# Altium schematic sheet HX-TYPE-C 24P-1.6 USB C 3.2 REC, HORZ1_HX-TYPE-C 24P-1.6 USB C 3.2 REC, HORZ.schdoc
size 124 x 101 mm
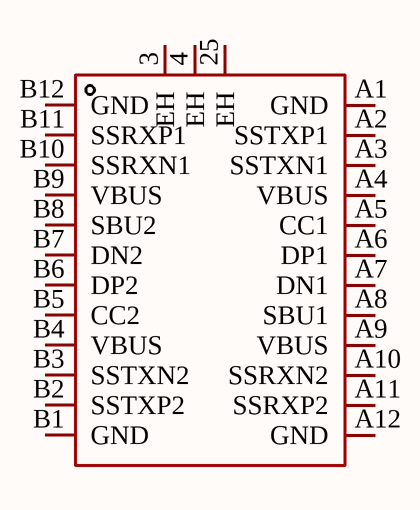
[diagram p0: HX-TYPE-C 24P-1.6 USB C 3.2 REC, HORZ1_HX-TYPE-C 24P-1.6 USB C 3.2 REC, HORZ.schdoc]

## Parts
USB?  HX-TYPE-C 24P-1.6 USB C 3.2 REC, HORZ  [USB-C-SMD_C49261591]  (value not drawn)

## Nets

Not connected (* = marked no-connect by the designer): USB? 3(EH) 4(EH) 25(EH) A1(GND) A2(SSTXP1) A3(SSTXN1) A4(VBUS) A5(CC1) A6(DP1) A7(DN1) A8(SBU1) A9(VBUS) A10(SSRXN2) A11(SSRXP2) A12(GND) B1(GND) B2(SSTXP2) B3(SSTXN2) B4(VBUS) B5(CC2) B6(DP2) B7(DN2) B8(SBU2) B9(VBUS) B10(SSRXN1) B11(SSRXP1) B12(GND)

## Library data of the parts
USB? = HX-TYPE-C 24P-1.6 USB C 3.2 REC, HORZ: Manufacturer: hanxia(韩下); Add into BOM: yes; Connector Type: Type-C; Protocol Standard: USB 3.1; Gender: Female; Number of Contacts: 24P; Number of Ports: 1; Current Rating-Power: 5A; Voltage Rating: 20V; Connect-Disconnect Life: 10,000 Cycles; Center Height: 0.08mm; Detection color: Black; Symbol: HX-TYPE-C 24P-1.6 USB C 3.2 REC, HORZ; Device: HX-TYPE-C 24P-1.6 USB C 3.2 REC, HORZ; LCSC Part Name: Type-C 母 沉板; Supplier Part: C49261591; Manufacturer Part: HX-TYPE-C 24P-1.6 USB C 3.2 REC, HORZ; Supplier Footprint: SMD; JLCPCB Part Class: Extended Part; Datasheet: https://item.szlcsc.com/datasheet/HX-TYPE-C%252024P-1.6%2520USB%2520C%25203.2%2520REC%252C%2520HORZ/51704545.html; Supplier: LCSC; Convert to PCB: yes; Mounting Type: Recessed Mount; Supplementary Features: -; Length: 7.9mm; Operating Temperature: -30℃~+80℃